# Altium project usb_pd_source.PrjPcb
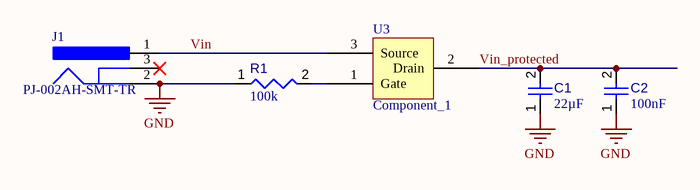
[diagram p0: sheet1_input_and_protection.SchDoc]
3 sheets, 22 parts. Net scope: global (net labels, ports and power ports of the same name join across sheets).
Board file: usb_pd_source.PcbDoc
Sheets:
  sheet1_input_and_protection.SchDoc
  sheet2_buck_converter.SchDoc
  sheet3_pd_controller.SchDoc

## Sheet sheet1_input_and_protection.SchDoc
size A; SheetNumber: 1; SheetTotal: 3

### Parts
C1  value 22µF  [CAPC0805(2012)145_L]  (hidden comment: Capacitor 22µF +/-40% 16V 0805)
C2  value 100nF  [CAPC1005X56X25LL10T15]  (hidden comment: Capacitor 0.1 uF +/- 5% 16 V 0402)
J1  PJ-002AH-SMT-TR  [CUI-PJ-002AH-4_V]
R1  value 100k  [RESC0402(1005)_L]  (hidden comment: 100KR2F)
U3  Component_1  [DPAK228P990X239-4N]

### Nets
GND: C1.1 C2.1 J1.2 R1.1
Vin: J1.1 U3.3(Source)
Vin_protected: C1.2 C2.2 U3.2(Drain)
NetR1_2: R1.2 U3.1(Gate)

Not connected (* = marked no-connect by the designer): J1 3*

### Library data of the parts
C1 = CMP-001-00081-4: Chip Capacitor, 22µF +/-40%, 16V, 0805, Thickness 1.45 mm; Tolerance: 5%; Voltage Rating: 16V; Mounting Technology: SMT; Pins: 2; Max Operating Temperature: 85°C; Case/Package: 0805; Min Operating Temperature: -55°C
C2 = CMP-001-00001-6: Chip Capacitor, 0.1 uF, +/- 5%, 16 V, 0402 (1005 Metric); Capacitor Type: Ceramic; Voltage Rating: 16V; Max Operating Temperature: 125°C; Min Operating Temperature: -55°C; Case/Package: 0402; Mounting Technology: SM; Pins: 2; Tolerance: 5%; RoHS Compliant: True
J1 = CMP-2000-06896-2: DC Power Jack, Right Angle, -25 to 85 degC, 4-Pin 14.8 x 9 x 11 mm SMD, RoHS, Tape and Reel; Manufacturer: CUIInc.; Brand: CUI; Inside Contact Diameter: 2mm; Voltage Rating: 24V; Insulation Resistance: 100MOhms; Outside Contact Diameter: 6.5mm; Current Rating: 5A; Mounting Angle: Right; Contact Plating: Nickel; Package Description: 4-Pin Surface Mount Device, Body 14.8 x 9 mm, Pitch 6.1 mm; Factory Pack Quantity: 350; Datasheet Version: Rev. 1.03, 11/2012; Operating Temperature Range: -25Cto+85C; Termination Style: SMD/SMT; Product: Jacks; Contact Gender: Male; Product Category: DCPowerConnectors; RoHS: True; Connector Type: DCPowerJack; Packaging: Reel; Contact Material: Brass; Flammability Rating: UL94V-0; Datasheet URL: http://www.cui.com/product/resource/pj-002ah-smt.pdf; Package Reference: PJ-002AH; Manufacturer URL: http://www.cui.com/; PartNumber: PJ-002AH; Mounting Style: SMD/SMT; Mounting Technology: SurfaceMount; Housing Material: Polyamide(PA)
R1 = CMP-009-00064-2: 100K 0.063W 1% 0402 (1005 Metric)  SMD; Power: 63mW; Case/Package: 0402; Mounting Technology: SMT; Pins: 2; Tolerance: 1%

## Sheet sheet2_buck_converter.SchDoc
size A; SheetNumber: 2; SheetTotal: 3
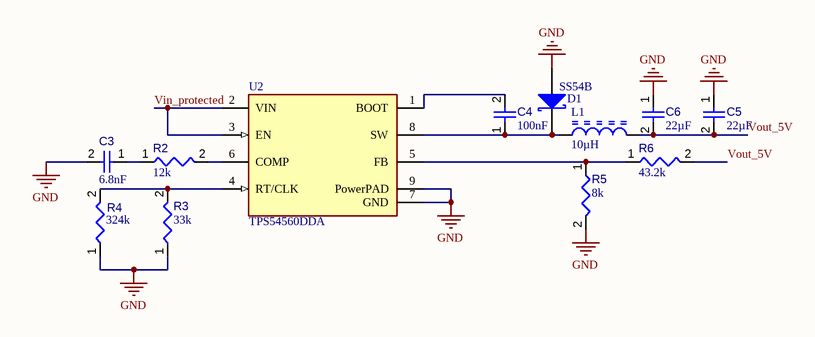
[diagram p1: sheet2_buck_converter.SchDoc]

### Parts
C3  value 6.8nF  [CAPC1005X56X25NL10T15]  (hidden comment: Capacitor 6.8 nF +/- 10% 16 V 0402)
C4  value 100nF  [CAPC1005X56X25LL10T15]  (hidden comment: Capacitor 0.1 uF +/- 5% 16 V 0402)
C5  value 22µF  [CAPC0805(2012)145_L]  (hidden comment: Capacitor 22µF +/-40% 16V 0805)
C6  value 22µF  [CAPC0805(2012)145_L]  (hidden comment: Capacitor 22µF +/-40% 16V 0805)
D1  SS54B  [JCET-SMB-2_M]
L1  Inductance: 10µH  [BOUR-CM322522_V]  (hidden comment: CM322522-100KL)
R2  value 12k  [RESC0402(1005)_L]  (hidden comment: 12KR2F)
R3  value 33k  [RESC1005X40X25ML10T10]  (hidden comment: Resistor 33k +/-5% 0402 63 mW)
R4  value 324k  [RESC0402(1005)_L]  (hidden comment: 324KR2F)
R5  value 8k  [RESC0402(1005)_L]  (hidden comment: Resistor 5K6  +/-5 % 0402 63 mW)
R6  value 43.2k  [RESC0402(1005)_L]  (hidden comment: Resistor 43K2 +/-1 % 0402 63 mW)
U2  TPS54560DDA  [FP-DDA0008E-MFG]

### Nets
GND: C3.2 C5.1 C6.1 D1.1(A) R3.1 R4.1 R5.2 U2.7(GND) U2.9(PowerPAD)
Vin_protected: U2.2(VIN) U2.3(EN)
Vout_5V: C5.2 C6.2 L1.2 R6.2
NetC3_1: C3.1 R2.1
NetC4_1: C4.1 D1.2(K) L1.1 U2.8(SW)
NetC4_2: C4.2 U2.1(BOOT)
NetR2_2: R2.2 U2.6(COMP)
NetR3_2: R3.2 R4.2 U2.4(RT/CLK)
NetR5_1: R5.1 R6.1 U2.5(FB)

### Library data of the parts
C3 = CMP-001-00000-6: Chip Capacitor, 6.8 nF, +/- 10%, 16 V, 0402 (1005 Metric); Capacitor Type: Ceramic; Voltage Rating: 16V; RoHS Compliant: True; Pins: 2; Case/Package: 0402; Min Operating Temperature: -55°C; Tolerance: 10%; Mounting Technology: SM; Max Operating Temperature: 125°C
C4 = CMP-001-00001-6: as C2 on sheet sheet1_input_and_protection; Max Operating Temperature: 125°C; Min Operating Temperature: -55°C; Case/Package: 0402; Mounting Technology: SM; Pins: 2; Tolerance: 5%; RoHS Compliant: True
C5 C6 = CMP-001-00081-4: as C1 on sheet sheet1_input_and_protection; Voltage Rating: 16V; Mounting Technology: SMT; Pins: 2; Max Operating Temperature: 85°C; Case/Package: 0805; Min Operating Temperature: -55°C
D1 = CMP-004-00006-2: Schottky Barrier Rectifier, 40 V, 5 A, -55 to 150 degC, 2-Pin SMD; Manufacturer: JCET; Datasheet URL: http://wiki.seeedstudio.com/images/3/3f/0310130P1.pdf; Datasheet Version: May-13; Package Reference: SMB-2; RoHS Compliant: Unknown; Manufacturer URL: http://www.cj-elec.com/; Mounting Technology: SM; Package Description: 2-Pin Surface Mount Device, Body 4.315 x 3.62 mm; Case/Package: SMB-2
L1 = CMP-006-00005-3: Chip Inductor, 10 uH, +/- 10%, -40 to 125 degC, 1210 (3225 Metric), RoHS, Tape and Reel; Manufacturer: Bourns; Current Rating: 140mA; Q Factor: 30; Self Resonant Frequency: 30MHz; Core Material: Ferrite; Shielding: Unshielded; Resistance: 2.1Ohm; Mounting Technology: SM; Min Operating Temperature: -20°C; Datasheet URL: http://www.murata.com/~/media/webrenewal/support/library/catalog/products/emc/emifil/c30e.ashx?la=en-gb; Case/Package: 1210; Pins: 2; Package Description: 2-Pin Surface Mount Device, Body 3.2 x 2.5 mm; RoHS Compliant: True; Max Operating Temperature: 100°C; Inductance Tolerance: 10%; Package Reference: 1210; Packaging: TapeandReel; Package Quantity: 1; Datasheet Version: Aug-14; Tolerance: 10%
R2 = CMP-009-00071-2: 12K 0.063W 1% 0402 (1005 Metric)  SMD; Power: 63mW; Tolerance: 1%; Case/Package: 0402; Mounting Technology: SMT; Pins: 2
R3 = CMP-009-00028-5: Chip Resistor, 33 KOhm, +/- 5%, 0.063 W, -55 to 155 degC, 0402 (1005 Metric); Power: 63mW; Tolerance: 5%; Case/Package: 0402; Mounting Technology: SM; Min Operating Temperature: -55°C; Max Operating Temperature: 155°C; Pins: 2; RoHS Compliant: True
R4 = CMP-009-00094-2: 324K 0.063W 1% 0402 (1005 Metric)  SMD; Power: 63mW; Tolerance: 1%; Pins: 2; Mounting Technology: SMT; Case/Package: 0402
R5 = CMP-009-00136-3: Chip Resistor, 5,6 kOhms, +/-5 %, 63 mW, -55 to 155 degC, 0402; Power: 63mW; Tolerance: 5%; Max Operating Temperature: 155°C; Case/Package: 0402; Min Operating Temperature: -55°C; Pins: 2
R6 = CMP-009-00154-3: Chip Resistor, 43,2 kOhms, +/-1 %, 63 mW, -55 to 155 degC, 0402; Tolerance: 1%; Power: 63mW; Pins: 2; Max Operating Temperature: 155°C; Min Operating Temperature: -55°C; Case/Package: 0402
U2 = CMP-04918-000033-1: IC REG BCK SPLIT RAIL ADJ 8SOPWR; Manufacturer: Texas Instruments; Min Supply Voltage: 4.5V; Switching Topology: Buck; Max Junction Temp: +150°C; Max Duty Cycle: 100%; Standoff Height: 0mm; Output Type: AdjustableProgrammable; Output Voltage: 0.8-58.8V; Output Current: 5A; Number Of Outputs: 1; Switching Frequency: 100-2500kHz; Max Supply Voltage: 60V; Nominal Supply Current: 146uA; Octopart: https://octopart.com/tps54560dda-texas+instruments-26977150; Temperature: -40°C to +125°C; ComponentLink2Description: Datasheet; Category: IC; Mouser Description: Voltage Regulators - Switching Regulators 60V Input 5 A SD DC-DC Cnvtr; Automotive: No; Ipc Land Pattern Name: SOIC127P600X170-8; Height: 1.7mm; RoHS: TRUE; ComponentLink2URL: http://www.ti.com/lit/ds/symlink/tps54560.pdf; Device Class L3: Voltage Regulators - Switching; Temperature Range High: +125°C; Device Class L2: Power Management ICs; Package: DDA0008E; Lead Free: Yes; Digikey Description: IC REG BCK SPLIT RAIL ADJ 8SOPWR; Device Class L1: Integrated Circuits (ICs); Manufacturer Part Number: TPS54560DDA; Temperature Range Low: -40°C

## Sheet sheet3_pd_controller.SchDoc
size A; SheetNumber: 3; SheetTotal: 3
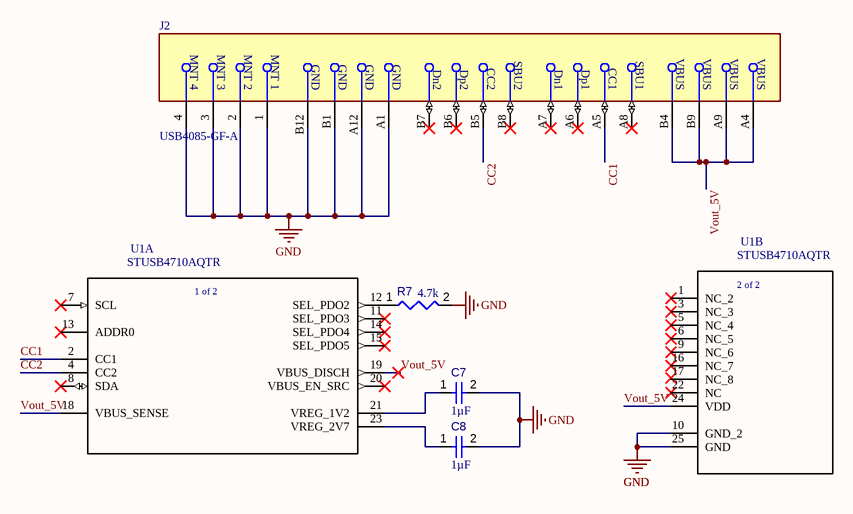
[diagram p2: sheet3_pd_controller.SchDoc]

### Parts
C7  value 1µF  [CAPC2013X135X45NL10T25]  (hidden comment: Capacitor 1 uF +/- 10% 50 V 0805)
C8  value 1µF  [CAPC2013X135X45NL10T25]  (hidden comment: Capacitor 1 uF +/- 10% 50 V 0805)
J2  USB4085-GF-A  [FP-USB4085-GF-A-MFG]
R7  value 4.7k  [RESC2013X70X40ML20T20]  (hidden comment: Resistor 4k7 +/-1% 0805 125 mW)
U1  STUSB4710AQTR  [*QFN24EP_4X4_STM]  (parts A,B of 2)

### Nets
GND: C7.2 C8.2 J2.1(MNT_1) J2.2(MNT_2) J2.3(MNT_3) J2.4(MNT_4) J2.A1(GND) J2.A12(GND) J2.B1(GND) J2.B12(GND) R7.2 U1.10(GND_2) U1.25(GND)
CC1: J2.A5(CC1) U1.2(CC1)
CC2: J2.B5(CC2) U1.4(CC2)
Vout_5V: J2.A4(VBUS) J2.A9(VBUS) J2.B4(VBUS) J2.B9(VBUS) U1.18(VBUS_SENSE) U1.19(VBUS_DISCH) U1.24(VDD)
NetC7_1: C7.1 U1.21(VREG_1V2)
NetC8_1: C8.1 U1.23(VREG_2V7)
NetR7_1: R7.1 U1.12(SEL_PDO2)

Not connected (* = marked no-connect by the designer): J2 A6(Dp1)* A7(Dn1)* A8(SBU1)* B6(Dp2)* B7(Dn2)* B8(SBU2)*; U1 1(NC_2)* 3(NC_3)* 5(NC_4)* 6(NC_5)* 7(SCL)* 8(SDA)* 9(NC_6)* 11(SEL_PDO3)* 13(ADDR0)* 14(SEL_PDO4)* 15(SEL_PDO5)* 16(NC_7)* 17(NC_8) 20(VBUS_EN_SRC)* 22(NC)*

### Notes on the sheet
- (in symbol CMP-036-000000-1, part A) 1 of 2
- (in symbol CMP-036-000000-1, part B) 2 of 2

### Library data of the parts
C7 C8 = CMP-001-00007-6: Chip Capacitor, 1 uF, +/- 10%, 50 V, 0805 (2012 Metric); Capacitor Type: Ceramic; Voltage Rating: 50V; Min Operating Temperature: -55°C; RoHS Compliant: True; Mounting Technology: SM; Case/Package: 0805; Max Operating Temperature: 125°C; Tolerance: 10%; Pins: 2
J2 = CMP-196119-000001-2: CONN RCPT USB2.0 TYPE C 24POS RA; Gender: Receptacle; Number of Positions: 16; USB Standard: USB 2.0; Orientation: Right Angle; Contact Plating: Gold; Contact Material: Copper Alloy
R7 = CMP-009-00032-5: Chip Resistor, 4.7 KOhm, +/- 1%, 0.125 W, -55 to 155 degC, 0805 (2012 Metric); Power: 125mW; Voltage Rating: 150V; Max Operating Temperature: 155°C; Min Operating Temperature: -55°C; Case/Package: 0805; RoHS Compliant: True; Pins: 2; Tolerance: 1%; Mounting Technology: SM
U1 = CMP-036-000000-1: USB Controller USB 2.0 I2C Interface 24-QFN (4x4); MF: STMicroelectronics; Value: *; Source: STUSB4710AQTR.SchLib; Design Item ID: STUSB4710AQTR; SnapEDA_Link: https://www.snapeda.com/parts/STUSB4710AQTR/STMicroelectronics/view-part/?ref=snap; MP: STUSB4710AQTR; Package: QFN-24 STMicroelectronics; Check_prices: https://www.snapeda.com/parts/STUSB4710AQTR/STMicroelectronics/view-part/?ref=eda

## Nets that join several sheets
GND: sheet1_input_and_protection (C1.1 C2.1 J1.2 R1.1), sheet2_buck_converter (9 pins), sheet3_pd_controller (13 pins)
Vin_protected: sheet1_input_and_protection (C1.2 C2.2 U3.2), sheet2_buck_converter (U2.2 U2.3)
Vout_5V: sheet2_buck_converter (C5.2 C6.2 L1.2 R6.2), sheet3_pd_controller (7 pins)